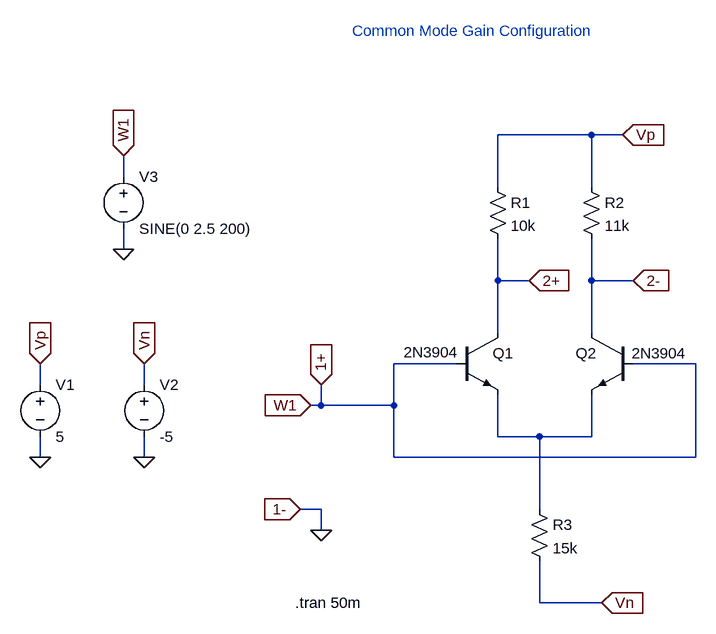
[diagram p0: schematic common_mode.asc]
common_mode.asc, the LTspice schematic file:
Version 4
SHEET 1 880 680
WIRE 352 -160 208 -160
WIRE 400 -160 352 -160
WIRE -368 -96 -368 -128
WIRE 208 -80 208 -160
WIRE 352 -80 352 -160
WIRE -368 16 -368 -16
WIRE 208 64 208 0
WIRE 256 64 208 64
WIRE 352 64 352 0
WIRE 416 64 352 64
WIRE 208 144 208 64
WIRE 352 144 352 64
WIRE 144 192 48 192
WIRE 512 192 416 192
WIRE -496 224 -496 192
WIRE -336 224 -336 192
WIRE -64 256 -64 224
WIRE -64 256 -80 256
WIRE 48 256 48 192
WIRE 48 256 -64 256
WIRE 208 304 208 240
WIRE 272 304 208 304
WIRE 352 304 352 240
WIRE 352 304 272 304
WIRE -496 336 -496 304
WIRE -336 336 -336 304
WIRE 48 336 48 256
WIRE 512 336 512 192
WIRE 512 336 48 336
WIRE -64 416 -96 416
WIRE 272 416 272 304
WIRE -64 448 -64 416
WIRE 272 560 272 496
WIRE 368 560 272 560
FLAG -80 256 W1
IOPIN -80 256 In
FLAG 368 560 Vn
IOPIN 368 560 In
FLAG 400 -160 Vp
IOPIN 400 -160 In
FLAG -496 336 0
FLAG -336 336 0
FLAG -368 16 0
FLAG -496 192 Vp
IOPIN -496 192 In
FLAG -336 192 Vn
IOPIN -336 192 In
FLAG -368 -128 W1
IOPIN -368 -128 In
FLAG -64 224 1+
IOPIN -64 224 In
FLAG 256 64 2+
IOPIN 256 64 In
FLAG 416 64 2-
IOPIN 416 64 In
FLAG -64 448 0
FLAG -96 416 1-
IOPIN -96 416 In
SYMBOL npn 144 144 R0
WINDOW 3 -81 30 Left 2
SYMATTR Value 2N3904
SYMATTR InstName Q1
SYMBOL npn 416 144 M0
WINDOW 3 -83 32 Left 2
SYMATTR Value 2N3904
SYMATTR InstName Q2
SYMBOL res 192 -96 R0
SYMATTR InstName R1
SYMATTR Value 10k
SYMBOL res 336 -96 R0
SYMATTR InstName R2
SYMATTR Value 11k
SYMBOL res 256 400 R0
SYMATTR InstName R3
SYMATTR Value 15k
SYMBOL voltage -496 208 R0
WINDOW 123 0 0 Left 0
WINDOW 39 0 0 Left 0
SYMATTR InstName V1
SYMATTR Value 5
SYMBOL voltage -336 208 R0
WINDOW 123 0 0 Left 0
WINDOW 39 0 0 Left 0
SYMATTR InstName V2
SYMATTR Value -5
SYMBOL voltage -368 -112 R0
WINDOW 123 0 0 Left 0
WINDOW 39 0 0 Left 0
SYMATTR InstName V3
SYMATTR Value SINE(0 2.5 200)
TEXT -104 560 Left 2 !.tran 50m
TEXT -16 -320 Left 2 ;Common Mode Gain Configuration

The netlist it stands for:
* common_mode.asc
Q1 2+ 1+ N001 0 2N3904
Q2 2- 1+ N001 0 2N3904
R1 Vp 2+ 10k
R2 Vp 2- 11k
R3 N001 Vn 15k
V1 Vp 0 5
V2 Vn 0 -5
V3 1+ 0 SINE(0 2.5 200)
.model NPN NPN
.model PNP PNP
.lib standard.bjt
.tran 50m
* Common Mode Gain Configuration
.backanno
.end